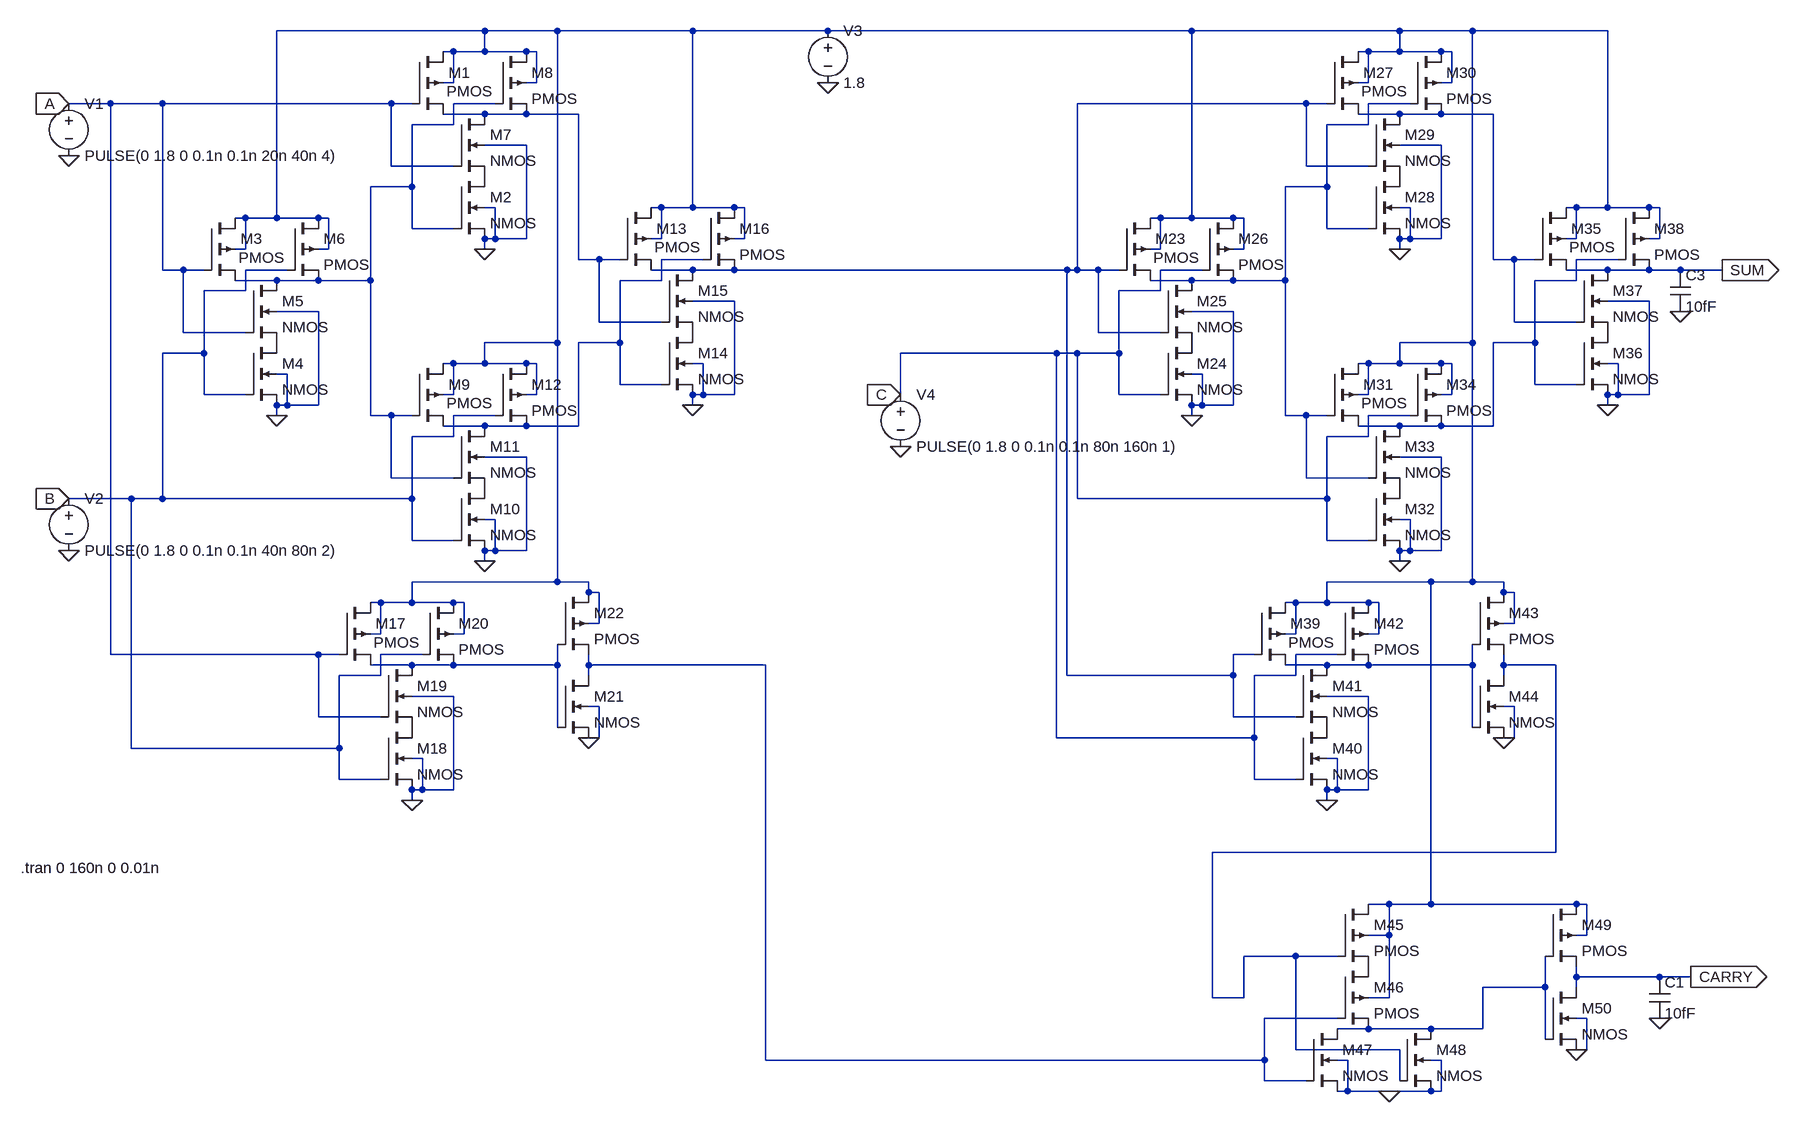
[diagram p0: schematic full-adder.asc]
full-adder.asc, the LTspice schematic file:
Version 4
SHEET 1 2128 1476
WIRE 112 -208 -208 -208
WIRE 224 -208 112 -208
WIRE 432 -208 224 -208
WIRE 640 -208 432 -208
WIRE 1200 -208 640 -208
WIRE 1520 -208 1200 -208
WIRE 1632 -208 1520 -208
WIRE 1840 -208 1632 -208
WIRE 64 -176 48 -176
WIRE 112 -176 112 -208
WIRE 112 -176 64 -176
WIRE 176 -176 112 -176
WIRE 192 -176 176 -176
WIRE 1472 -176 1456 -176
WIRE 1520 -176 1520 -208
WIRE 1520 -176 1472 -176
WIRE 1584 -176 1520 -176
WIRE 1600 -176 1584 -176
WIRE 64 -128 64 -176
WIRE 64 -128 48 -128
WIRE 192 -128 192 -176
WIRE 192 -128 176 -128
WIRE 1472 -128 1472 -176
WIRE 1472 -128 1456 -128
WIRE 1600 -128 1600 -176
WIRE 1600 -128 1584 -128
WIRE -464 -96 -528 -96
WIRE -384 -96 -464 -96
WIRE -32 -96 -384 -96
WIRE 0 -96 -32 -96
WIRE 128 -96 64 -96
WIRE 1376 -96 1024 -96
WIRE 1408 -96 1376 -96
WIRE 1536 -96 1472 -96
WIRE 112 -80 48 -80
WIRE 176 -80 112 -80
WIRE 256 -80 176 -80
WIRE 1520 -80 1456 -80
WIRE 1584 -80 1520 -80
WIRE 1664 -80 1584 -80
WIRE 64 -64 64 -96
WIRE 64 -64 0 -64
WIRE 1472 -64 1472 -96
WIRE 1472 -64 1408 -64
WIRE 176 -32 112 -32
WIRE 1584 -32 1520 -32
WIRE -32 0 -32 -96
WIRE 64 0 -32 0
WIRE 1376 0 1376 -96
WIRE 1472 0 1376 0
WIRE 0 32 0 -64
WIRE 0 32 -64 32
WIRE 1408 32 1408 -64
WIRE 1408 32 1344 32
WIRE 128 64 112 64
WIRE 384 64 368 64
WIRE 432 64 432 -208
WIRE 432 64 384 64
WIRE 496 64 432 64
WIRE 512 64 496 64
WIRE 1536 64 1520 64
WIRE 1792 64 1776 64
WIRE 1840 64 1840 -208
WIRE 1840 64 1792 64
WIRE 1904 64 1840 64
WIRE 1920 64 1904 64
WIRE -256 80 -272 80
WIRE -208 80 -208 -208
WIRE -208 80 -256 80
WIRE -144 80 -208 80
WIRE -128 80 -144 80
WIRE 1152 80 1136 80
WIRE 1200 80 1200 -208
WIRE 1200 80 1152 80
WIRE 1264 80 1200 80
WIRE 1280 80 1264 80
WIRE 0 96 0 32
WIRE 64 96 0 96
WIRE 1408 96 1408 32
WIRE 1472 96 1408 96
WIRE 128 112 128 64
WIRE 128 112 112 112
WIRE 176 112 176 -32
WIRE 176 112 128 112
WIRE 384 112 384 64
WIRE 384 112 368 112
WIRE 512 112 512 64
WIRE 512 112 496 112
WIRE 1536 112 1536 64
WIRE 1536 112 1520 112
WIRE 1584 112 1584 -32
WIRE 1584 112 1536 112
WIRE 1792 112 1792 64
WIRE 1792 112 1776 112
WIRE 1920 112 1920 64
WIRE 1920 112 1904 112
WIRE -256 128 -256 80
WIRE -256 128 -272 128
WIRE -128 128 -128 80
WIRE -128 128 -144 128
WIRE 112 128 112 112
WIRE 1152 128 1152 80
WIRE 1152 128 1136 128
WIRE 1280 128 1280 80
WIRE 1280 128 1264 128
WIRE 1520 128 1520 112
WIRE 256 144 256 -80
WIRE 288 144 256 144
WIRE 320 144 288 144
WIRE 448 144 384 144
WIRE 1664 144 1664 -80
WIRE 1696 144 1664 144
WIRE 1728 144 1696 144
WIRE 1856 144 1792 144
WIRE -384 160 -384 -96
WIRE -352 160 -384 160
WIRE -320 160 -352 160
WIRE -192 160 -256 160
WIRE 432 160 368 160
WIRE 496 160 432 160
WIRE 1008 160 496 160
WIRE 1024 160 1024 -96
WIRE 1024 160 1008 160
WIRE 1056 160 1024 160
WIRE 1088 160 1056 160
WIRE 1216 160 1152 160
WIRE 1840 160 1776 160
WIRE 1904 160 1840 160
WIRE 1952 160 1904 160
WIRE 2016 160 1952 160
WIRE -208 176 -272 176
WIRE -144 176 -208 176
WIRE -64 176 -64 32
WIRE -64 176 -144 176
WIRE 384 176 384 144
WIRE 384 176 320 176
WIRE 1200 176 1136 176
WIRE 1264 176 1200 176
WIRE 1344 176 1344 32
WIRE 1344 176 1264 176
WIRE 1792 176 1792 144
WIRE 1792 176 1728 176
WIRE -256 192 -256 160
WIRE -256 192 -320 192
WIRE 1152 192 1152 160
WIRE 1152 192 1088 192
WIRE 496 208 432 208
WIRE 1904 208 1840 208
WIRE -144 224 -208 224
WIRE 1264 224 1200 224
WIRE 288 240 288 144
WIRE 384 240 288 240
WIRE 1696 240 1696 144
WIRE 1792 240 1696 240
WIRE -352 256 -352 160
WIRE -256 256 -352 256
WIRE 1056 256 1056 160
WIRE 1152 256 1056 256
WIRE 224 272 224 -208
WIRE 224 272 112 272
WIRE 320 272 320 176
WIRE 320 272 256 272
WIRE 1632 272 1632 -208
WIRE 1632 272 1520 272
WIRE 1728 272 1728 176
WIRE 1728 272 1664 272
WIRE -320 288 -320 192
WIRE -320 288 -384 288
WIRE 992 288 752 288
WIRE 1024 288 992 288
WIRE 1088 288 1088 192
WIRE 1088 288 1024 288
WIRE 64 304 48 304
WIRE 112 304 112 272
WIRE 112 304 64 304
WIRE 176 304 112 304
WIRE 192 304 176 304
WIRE 448 304 432 304
WIRE 1472 304 1456 304
WIRE 1520 304 1520 272
WIRE 1520 304 1472 304
WIRE 1584 304 1520 304
WIRE 1600 304 1584 304
WIRE 1856 304 1840 304
WIRE -192 320 -208 320
WIRE 1216 320 1200 320
WIRE 320 336 320 272
WIRE 384 336 320 336
WIRE 1728 336 1728 272
WIRE 1792 336 1728 336
WIRE -320 352 -320 288
WIRE -256 352 -320 352
WIRE 64 352 64 304
WIRE 64 352 48 352
WIRE 192 352 192 304
WIRE 192 352 176 352
WIRE 448 352 448 304
WIRE 448 352 432 352
WIRE 496 352 496 208
WIRE 496 352 448 352
WIRE 752 352 752 288
WIRE 1088 352 1088 288
WIRE 1152 352 1088 352
WIRE 1472 352 1472 304
WIRE 1472 352 1456 352
WIRE 1600 352 1600 304
WIRE 1600 352 1584 352
WIRE 1856 352 1856 304
WIRE 1856 352 1840 352
WIRE 1904 352 1904 208
WIRE 1904 352 1856 352
WIRE -192 368 -192 320
WIRE -192 368 -208 368
WIRE -144 368 -144 224
WIRE -144 368 -192 368
WIRE 432 368 432 352
WIRE 1216 368 1216 320
WIRE 1216 368 1200 368
WIRE 1264 368 1264 224
WIRE 1264 368 1216 368
WIRE 1840 368 1840 352
WIRE -208 384 -208 368
WIRE -64 384 -64 176
WIRE -32 384 -64 384
WIRE 0 384 -32 384
WIRE 128 384 64 384
WIRE 1200 384 1200 368
WIRE 1344 384 1344 176
WIRE 1376 384 1344 384
WIRE 1408 384 1376 384
WIRE 1536 384 1472 384
WIRE 112 400 48 400
WIRE 176 400 112 400
WIRE 256 400 256 272
WIRE 256 400 176 400
WIRE 1520 400 1456 400
WIRE 1584 400 1520 400
WIRE 1664 400 1664 272
WIRE 1664 400 1584 400
WIRE 64 416 64 384
WIRE 64 416 0 416
WIRE 1472 416 1472 384
WIRE 1472 416 1408 416
WIRE 176 448 112 448
WIRE 1584 448 1520 448
WIRE -32 480 -32 384
WIRE 64 480 -32 480
WIRE 1376 480 1376 384
WIRE 1472 480 1376 480
WIRE -432 512 -528 512
WIRE -384 512 -384 288
WIRE -384 512 -432 512
WIRE 0 512 0 416
WIRE 0 512 -384 512
WIRE 1024 512 1024 288
WIRE 1408 512 1408 416
WIRE 1408 512 1024 512
WIRE 128 544 112 544
WIRE 1536 544 1520 544
WIRE 0 576 0 512
WIRE 64 576 0 576
WIRE 1408 576 1408 512
WIRE 1472 576 1408 576
WIRE 128 592 128 544
WIRE 128 592 112 592
WIRE 176 592 176 448
WIRE 176 592 128 592
WIRE 1536 592 1536 544
WIRE 1536 592 1520 592
WIRE 1584 592 1584 448
WIRE 1584 592 1536 592
WIRE 112 608 112 592
WIRE 1520 608 1520 592
WIRE 224 640 224 272
WIRE 224 640 0 640
WIRE 272 640 224 640
WIRE 1568 640 1408 640
WIRE 1632 640 1632 272
WIRE 1632 640 1568 640
WIRE 1680 640 1632 640
WIRE 272 656 272 640
WIRE 288 656 272 656
WIRE 1680 656 1680 640
WIRE 1696 656 1680 656
WIRE -48 672 -64 672
WIRE 0 672 0 640
WIRE 0 672 -48 672
WIRE 64 672 0 672
WIRE 80 672 64 672
WIRE 1360 672 1344 672
WIRE 1408 672 1408 640
WIRE 1408 672 1360 672
WIRE 1472 672 1408 672
WIRE 1488 672 1472 672
WIRE 288 704 288 656
WIRE 288 704 272 704
WIRE 1696 704 1696 656
WIRE 1696 704 1680 704
WIRE -48 720 -48 672
WIRE -48 720 -64 720
WIRE 80 720 80 672
WIRE 80 720 64 720
WIRE 1360 720 1360 672
WIRE 1360 720 1344 720
WIRE 1488 720 1488 672
WIRE 1488 720 1472 720
WIRE -464 752 -464 -96
WIRE -144 752 -464 752
WIRE -112 752 -144 752
WIRE 16 752 -48 752
WIRE 1296 752 1264 752
WIRE 1424 752 1360 752
WIRE 0 768 -64 768
WIRE 64 768 0 768
WIRE 224 768 224 736
WIRE 224 768 64 768
WIRE 272 768 272 752
WIRE 544 768 272 768
WIRE 1408 768 1344 768
WIRE 1472 768 1408 768
WIRE 1632 768 1632 736
WIRE 1632 768 1472 768
WIRE 1680 768 1680 752
WIRE 1760 768 1680 768
WIRE -48 784 -48 752
WIRE -48 784 -112 784
WIRE 272 784 272 768
WIRE 1008 784 1008 160
WIRE 1264 784 1264 752
WIRE 1264 784 1008 784
WIRE 1360 784 1360 752
WIRE 1360 784 1296 784
WIRE 1680 784 1680 768
WIRE 64 816 0 816
WIRE 1472 816 1408 816
WIRE 288 832 272 832
WIRE 1696 832 1680 832
WIRE -144 848 -144 752
WIRE -48 848 -144 848
WIRE 1264 848 1264 784
WIRE 1360 848 1264 848
WIRE 224 864 224 768
WIRE 1632 864 1632 768
WIRE 288 880 288 832
WIRE 288 880 272 880
WIRE 992 880 992 288
WIRE 1296 880 1296 784
WIRE 1296 880 992 880
WIRE 1696 880 1696 832
WIRE 1696 880 1680 880
WIRE -432 896 -432 512
WIRE -112 896 -112 784
WIRE -112 896 -432 896
WIRE 16 912 0 912
WIRE 1424 912 1408 912
WIRE -112 944 -112 896
WIRE -48 944 -112 944
WIRE 1296 944 1296 880
WIRE 1360 944 1296 944
WIRE 16 960 16 912
WIRE 16 960 0 960
WIRE 64 960 64 816
WIRE 64 960 16 960
WIRE 1424 960 1424 912
WIRE 1424 960 1408 960
WIRE 1472 960 1472 816
WIRE 1472 960 1424 960
WIRE 0 976 0 960
WIRE 1408 976 1408 960
WIRE 1760 1056 1760 768
WIRE 1760 1056 1232 1056
WIRE 1504 1136 1472 1136
WIRE 1568 1136 1568 640
WIRE 1568 1136 1504 1136
WIRE 1792 1136 1568 1136
WIRE 1808 1136 1792 1136
WIRE 1504 1184 1504 1136
WIRE 1504 1184 1472 1184
WIRE 1808 1184 1808 1136
WIRE 1808 1184 1792 1184
WIRE 1360 1216 1280 1216
WIRE 1424 1216 1360 1216
WIRE 1792 1248 1792 1232
WIRE 1920 1248 1792 1248
WIRE 1968 1248 1920 1248
WIRE 1744 1264 1744 1216
WIRE 1744 1264 1648 1264
WIRE 1792 1264 1792 1248
WIRE 1232 1280 1232 1056
WIRE 1280 1280 1280 1216
WIRE 1280 1280 1232 1280
WIRE 1504 1280 1504 1184
WIRE 1504 1280 1472 1280
WIRE 1424 1312 1312 1312
WIRE 1808 1312 1792 1312
WIRE 1472 1328 1424 1328
WIRE 1568 1328 1472 1328
WIRE 1648 1328 1648 1264
WIRE 1648 1328 1568 1328
WIRE 1744 1344 1744 1264
WIRE 1360 1360 1360 1216
WIRE 1520 1360 1360 1360
WIRE 1808 1360 1808 1312
WIRE 1808 1360 1792 1360
WIRE 544 1376 544 768
WIRE 1312 1376 1312 1312
WIRE 1312 1376 544 1376
WIRE 1440 1376 1424 1376
WIRE 1584 1376 1568 1376
WIRE 1312 1408 1312 1376
WIRE 1376 1408 1312 1408
WIRE 1520 1408 1520 1360
WIRE 1440 1424 1440 1376
WIRE 1440 1424 1424 1424
WIRE 1504 1424 1440 1424
WIRE 1568 1424 1504 1424
WIRE 1584 1424 1584 1376
WIRE 1584 1424 1568 1424
FLAG -208 384 0
FLAG 112 128 0
FLAG 112 608 0
FLAG 432 368 0
FLAG 0 976 0
FLAG -528 -16 0
FLAG -528 592 0
FLAG 2016 160 SUM
IOPIN 2016 160 Out
FLAG 1968 1248 CARRY
IOPIN 1968 1248 Out
FLAG -528 -96 A
IOPIN -528 -96 In
FLAG -528 512 B
IOPIN -528 512 In
FLAG 640 -128 0
FLAG 272 880 0
FLAG 1200 384 0
FLAG 1520 128 0
FLAG 1520 608 0
FLAG 1840 368 0
FLAG 1408 976 0
FLAG 1952 224 0
FLAG 1680 880 0
FLAG 1792 1360 0
FLAG 752 432 0
FLAG 752 352 C
IOPIN 752 352 In
FLAG 1920 1312 0
FLAG 1504 1424 0
SYMBOL pmos4 -320 80 R0
WINDOW 3 53 61 Left 2
SYMATTR InstName M3
SYMATTR Value2 l=180n w=810n
SYMBOL nmos4 -256 272 R0
SYMATTR InstName M4
SYMATTR Value2 l=180n w=270n
SYMBOL nmos4 -256 176 R0
SYMATTR InstName M5
SYMATTR Value2 l=180n w=270n
SYMBOL pmos4 -192 80 R0
SYMATTR InstName M6
SYMATTR Value2 l=180n w=810n
SYMBOL pmos4 0 -176 R0
WINDOW 3 53 61 Left 2
SYMATTR InstName M1
SYMATTR Value2 l=180n w=810n
SYMBOL nmos4 64 16 R0
SYMATTR InstName M2
SYMATTR Value2 l=180n w=270n
SYMBOL nmos4 64 -80 R0
SYMATTR InstName M7
SYMATTR Value2 l=180n w=270n
SYMBOL pmos4 128 -176 R0
SYMATTR InstName M8
SYMATTR Value2 l=180n w=810n
SYMBOL pmos4 0 304 R0
WINDOW 3 53 61 Left 2
SYMATTR InstName M9
SYMATTR Value2 l=180n w=810n
SYMBOL nmos4 64 496 R0
SYMATTR InstName M10
SYMATTR Value2 l=180n w=270n
SYMBOL nmos4 64 400 R0
SYMATTR InstName M11
SYMATTR Value2 l=180n w=270n
SYMBOL pmos4 128 304 R0
SYMATTR InstName M12
SYMATTR Value2 l=180n w=810n
SYMBOL pmos4 320 64 R0
WINDOW 3 53 61 Left 2
SYMATTR InstName M13
SYMATTR Value2 l=180n w=810n
SYMBOL nmos4 384 256 R0
SYMATTR InstName M14
SYMATTR Value2 l=180n w=270n
SYMBOL nmos4 384 160 R0
SYMATTR InstName M15
SYMATTR Value2 l=180n w=270n
SYMBOL pmos4 448 64 R0
SYMATTR InstName M16
SYMATTR Value2 l=180n w=810n
SYMBOL pmos4 -112 672 R0
WINDOW 3 53 61 Left 2
SYMATTR InstName M17
SYMATTR Value2 l=180n w=810n
SYMBOL nmos4 -48 864 R0
SYMATTR InstName M18
SYMATTR Value2 l=180n w=270n
SYMBOL nmos4 -48 768 R0
SYMATTR InstName M19
SYMATTR Value2 l=180n w=270n
SYMBOL pmos4 16 672 R0
SYMATTR InstName M20
SYMATTR Value2 l=180n w=810n
SYMBOL pmos4 224 656 R0
SYMATTR InstName M22
SYMATTR Value2 l=180n w=810n
SYMBOL voltage -528 -112 R0
WINDOW 123 0 0 Left 0
WINDOW 39 0 0 Left 0
SYMATTR InstName V1
SYMATTR Value PULSE(0 1.8 0 0.1n 0.1n 20n 40n 4)
SYMBOL voltage -528 496 R0
WINDOW 123 0 0 Left 0
WINDOW 39 0 0 Left 0
SYMATTR InstName V2
SYMATTR Value PULSE(0 1.8 0 0.1n 0.1n 40n 80n 2)
SYMBOL voltage 640 -224 R0
WINDOW 123 0 0 Left 0
WINDOW 39 0 0 Left 0
SYMATTR InstName V3
SYMATTR Value 1.8
SYMBOL nmos4 224 784 R0
SYMATTR InstName M21
SYMATTR Value2 l=180n w=270n
SYMBOL pmos4 1088 80 R0
WINDOW 3 53 61 Left 2
SYMATTR InstName M23
SYMATTR Value2 l=180n w=810n
SYMBOL nmos4 1152 272 R0
SYMATTR InstName M24
SYMATTR Value2 l=180n w=270n
SYMBOL nmos4 1152 176 R0
SYMATTR InstName M25
SYMATTR Value2 l=180n w=270n
SYMBOL pmos4 1216 80 R0
SYMATTR InstName M26
SYMATTR Value2 l=180n w=810n
SYMBOL pmos4 1408 -176 R0
WINDOW 3 53 61 Left 2
SYMATTR InstName M27
SYMATTR Value2 l=180n w=810n
SYMBOL nmos4 1472 16 R0
SYMATTR InstName M28
SYMATTR Value2 l=180n w=270n
SYMBOL nmos4 1472 -80 R0
SYMATTR InstName M29
SYMATTR Value2 l=180n w=270n
SYMBOL pmos4 1536 -176 R0
SYMATTR InstName M30
SYMATTR Value2 l=180n w=810n
SYMBOL pmos4 1408 304 R0
WINDOW 3 53 61 Left 2
SYMATTR InstName M31
SYMATTR Value2 l=180n w=810n
SYMBOL nmos4 1472 496 R0
SYMATTR InstName M32
SYMATTR Value2 l=180n w=270n
SYMBOL nmos4 1472 400 R0
SYMATTR InstName M33
SYMATTR Value2 l=180n w=270n
SYMBOL pmos4 1536 304 R0
SYMATTR InstName M34
SYMATTR Value2 l=180n w=810n
SYMBOL pmos4 1728 64 R0
WINDOW 3 53 61 Left 2
SYMATTR InstName M35
SYMATTR Value2 l=180n w=810n
SYMBOL nmos4 1792 256 R0
SYMATTR InstName M36
SYMATTR Value2 l=180n w=270n
SYMBOL nmos4 1792 160 R0
SYMATTR InstName M37
SYMATTR Value2 l=180n w=270n
SYMBOL pmos4 1856 64 R0
SYMATTR InstName M38
SYMATTR Value2 l=180n w=810n
SYMBOL pmos4 1296 672 R0
WINDOW 3 53 61 Left 2
SYMATTR InstName M39
SYMATTR Value2 l=180n w=810n
SYMBOL nmos4 1360 864 R0
SYMATTR InstName M40
SYMATTR Value2 l=180n w=270n
SYMBOL nmos4 1360 768 R0
SYMATTR InstName M41
SYMATTR Value2 l=180n w=270n
SYMBOL pmos4 1424 672 R0
SYMATTR InstName M42
SYMATTR Value2 l=180n w=810n
SYMBOL pmos4 1632 656 R0
SYMATTR InstName M43
SYMATTR Value2 l=180n w=810n
SYMBOL cap 1936 160 R0
SYMATTR InstName C3
SYMATTR Value 10fF
SYMBOL nmos4 1632 784 R0
SYMATTR InstName M44
SYMATTR Value2 l=180n w=270n
SYMBOL pmos4 1744 1136 R0
SYMATTR InstName M49
SYMATTR Value2 l=180n w=810n
SYMBOL nmos4 1744 1264 R0
SYMATTR InstName M50
SYMATTR Value2 l=180n w=270n
SYMBOL voltage 752 336 R0
WINDOW 123 0 0 Left 0
WINDOW 39 0 0 Left 0
SYMATTR InstName V4
SYMATTR Value PULSE(0 1.8 0 0.1n 0.1n 80n 160n 1)
SYMBOL cap 1904 1248 R0
SYMATTR InstName C1
SYMATTR Value 10fF
SYMBOL pmos4 1424 1136 R0
SYMATTR InstName M45
SYMATTR Value2 l=180n w=810n
SYMBOL pmos4 1424 1232 R0
SYMATTR InstName M46
SYMATTR Value2 l=180n w=810n
SYMBOL nmos4 1376 1328 R0
SYMATTR InstName M47
SYMATTR Value2 l=180n w=270n
SYMBOL nmos4 1520 1328 R0
SYMATTR InstName M48
SYMATTR Value2 l=180n w=270n
TEXT -602 1080 Left 2 !.tran 0 160n 0 0.01n

The netlist it stands for:
* full-adder.asc
M3 N001 A N002 N001 PMOS l=180n w=810n
M4 P001 B 0 0 NMOS l=180n w=270n
M5 N002 A P001 0 NMOS l=180n w=270n
M6 N001 B N002 N001 PMOS l=180n w=810n
M1 N001 A N005 N001 PMOS l=180n w=810n
M2 P002 N002 0 0 NMOS l=180n w=270n
M7 N005 A P002 0 NMOS l=180n w=270n
M8 N001 N002 N005 N001 PMOS l=180n w=810n
M9 N001 N002 N007 N001 PMOS l=180n w=810n
M10 P003 B 0 0 NMOS l=180n w=270n
M11 N007 N002 P003 0 NMOS l=180n w=270n
M12 N001 B N007 N001 PMOS l=180n w=810n
M13 N001 N005 N003 N001 PMOS l=180n w=810n
M14 P004 N007 0 0 NMOS l=180n w=270n
M15 N003 N005 P004 0 NMOS l=180n w=270n
M16 N001 N007 N003 N001 PMOS l=180n w=810n
M17 N001 A N009 N001 PMOS l=180n w=810n
M18 P005 B 0 0 NMOS l=180n w=270n
M19 N009 A P005 0 NMOS l=180n w=270n
M20 N001 B N009 N001 PMOS l=180n w=810n
M22 N001 N009 N010 N001 PMOS l=180n w=810n
V1 A 0 PULSE(0 1.8 0 0.1n 0.1n 20n 40n 4)
V2 B 0 PULSE(0 1.8 0 0.1n 0.1n 40n 80n 2)
V3 N001 0 1.8
M21 N010 N009 0 0 NMOS l=180n w=270n
M23 N001 N003 N004 N001 PMOS l=180n w=810n
M24 P006 C 0 0 NMOS l=180n w=270n
M25 N004 N003 P006 0 NMOS l=180n w=270n
M26 N001 C N004 N001 PMOS l=180n w=810n
M27 N001 N003 N006 N001 PMOS l=180n w=810n
M28 P007 N004 0 0 NMOS l=180n w=270n
M29 N006 N003 P007 0 NMOS l=180n w=270n
M30 N001 N004 N006 N001 PMOS l=180n w=810n
M31 N001 N004 N008 N001 PMOS l=180n w=810n
M32 P008 C 0 0 NMOS l=180n w=270n
M33 N008 N004 P008 0 NMOS l=180n w=270n
M34 N001 C N008 N001 PMOS l=180n w=810n
M35 N001 N006 SUM N001 PMOS l=180n w=810n
M36 P009 N008 0 0 NMOS l=180n w=270n
M37 SUM N006 P009 0 NMOS l=180n w=270n
M38 N001 N008 SUM N001 PMOS l=180n w=810n
M39 N001 N003 N011 N001 PMOS l=180n w=810n
M40 P010 C 0 0 NMOS l=180n w=270n
M41 N011 N003 P010 0 NMOS l=180n w=270n
M42 N001 C N011 N001 PMOS l=180n w=810n
M43 N001 N011 N012 N001 PMOS l=180n w=810n
C3 SUM 0 10fF
M44 N012 N011 0 0 NMOS l=180n w=270n
M49 N001 N013 CARRY N001 PMOS l=180n w=810n
M50 CARRY N013 0 0 NMOS l=180n w=270n
V4 C 0 PULSE(0 1.8 0 0.1n 0.1n 80n 160n 1)
C1 CARRY 0 10fF
M45 N001 N012 P011 N001 PMOS l=180n w=810n
M46 P011 N010 N013 N001 PMOS l=180n w=810n
M47 N013 N010 0 0 NMOS l=180n w=270n
M48 N013 N012 0 0 NMOS l=180n w=270n
.model NMOS NMOS
.model PMOS PMOS
.lib standard.mos
.tran 0 160n 0 0.01n
.backanno
.end